# EAGLE design esp-07:12:12e (EAGLE 7.3.0)
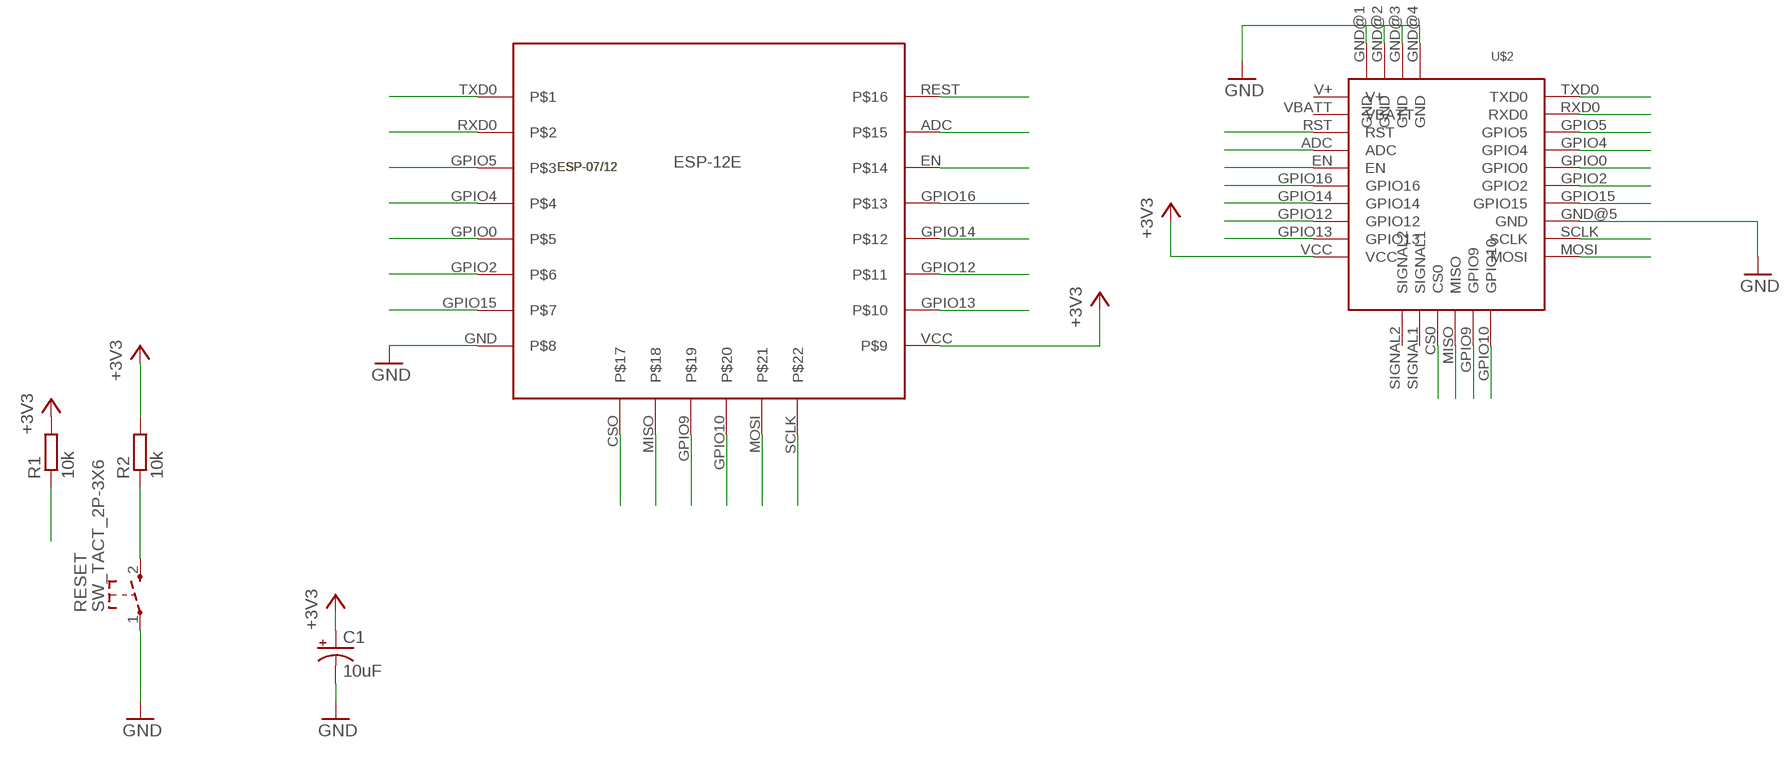
[diagram p0: schematic, sheet 1]

## Parts
C1  10uF  10UF-16V-10%(TANT)  [EIA3216]
R1  10k  RESISTOR-1206  [R1206]
R2  10k  RESISTOR-1206  [R1206]
RESET  SW_TACT_2P-3X6  [SW_TACT_3X6]
U$1  ESP-07/12_ESP-12E  [ESP-07/12]
U$2  ESP-BOARD  [ESP-BOARD]

## Nets
+3V3: C1.A(+) R1.2 R2.2 U$1.VCC U$2.VCC
ADC: U$1.ADC U$2.ADC
CS0: U$1.CSO U$2.CS0
EN: R1.1 U$1.EN U$2.EN
GND: C1.C(-) RESET.1 U$1.GND U$2.GND@1(GND) U$2.GND@2(GND) U$2.GND@3(GND) U$2.GND@4(GND) U$2.GND@5(GND)
GPIO0: U$1.GPIO0 U$2.GPIO0
GPIO2: U$1.GPIO2 U$2.GPIO2
GPIO4: U$1.GPIO4 U$2.GPIO4
GPIO5: U$1.GPIO5 U$2.GPIO5
GPIO9: U$1.GPIO9 U$2.GPIO9
GPIO10: U$1.GPIO10 U$2.GPIO10
GPIO12: U$1.GPIO12 U$2.GPIO12
GPIO13: U$1.GPIO13 U$2.GPIO13
GPIO14: U$1.GPIO14 U$2.GPIO14
GPIO15: U$1.GPIO15 U$2.GPIO15
GPIO16: U$1.GPIO16 U$2.GPIO16
MISO: U$1.MISO U$2.MISO
MOSI: U$1.MOSI U$2.MOSI
RESET: R2.1 RESET.2 U$1.REST U$2.RST
RXD0: U$1.RXD0 U$2.RXD0
SCLK: U$1.SCLK U$2.SCLK
TXD0: U$1.TXD0 U$2.TXD0
Unconnected: U$2.SIGNAL1 U$2.SIGNAL2

## Power pins joined to a net without a drawn wire
V+: U$2.V+
VBATT: U$2.VBATT

## Library data of the parts
C1 = SparkFun-Capacitors:10UF-16V-10%(TANT): CAP-00811 1206/EIA-3216 Tantalum capacitor; PROD_ID: CAP-00811
R1 R2 = dp_devices:RESISTOR
RESET = dp_devices:SW_TACT_2P
U$1 = ESP-12E:ESP-07/12: Version 1.0 of the library for the ESP-07/12 full GPIO dev board module byME Jon jonnyradu@gmail.com
U$2 = ESPstack:ESP-BOARD: STANDARIZED ESP-STACK BOARD

## Board
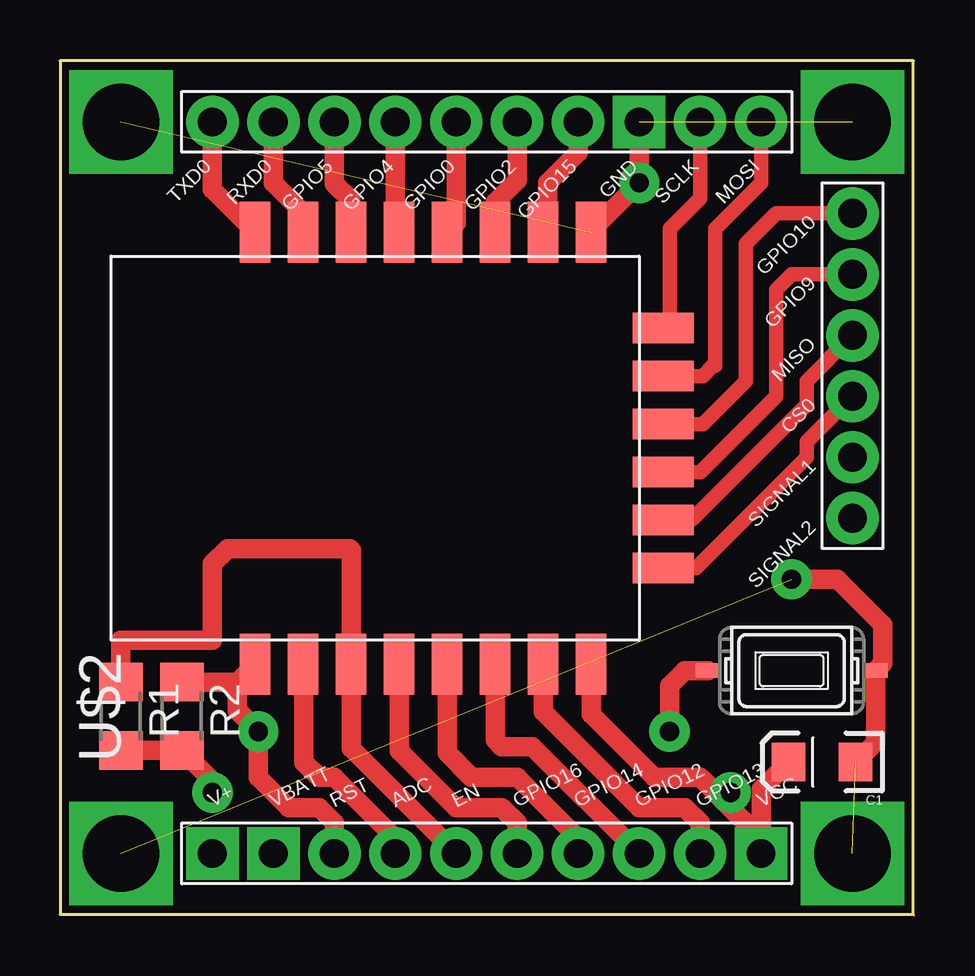
[diagram p1: board, top side]
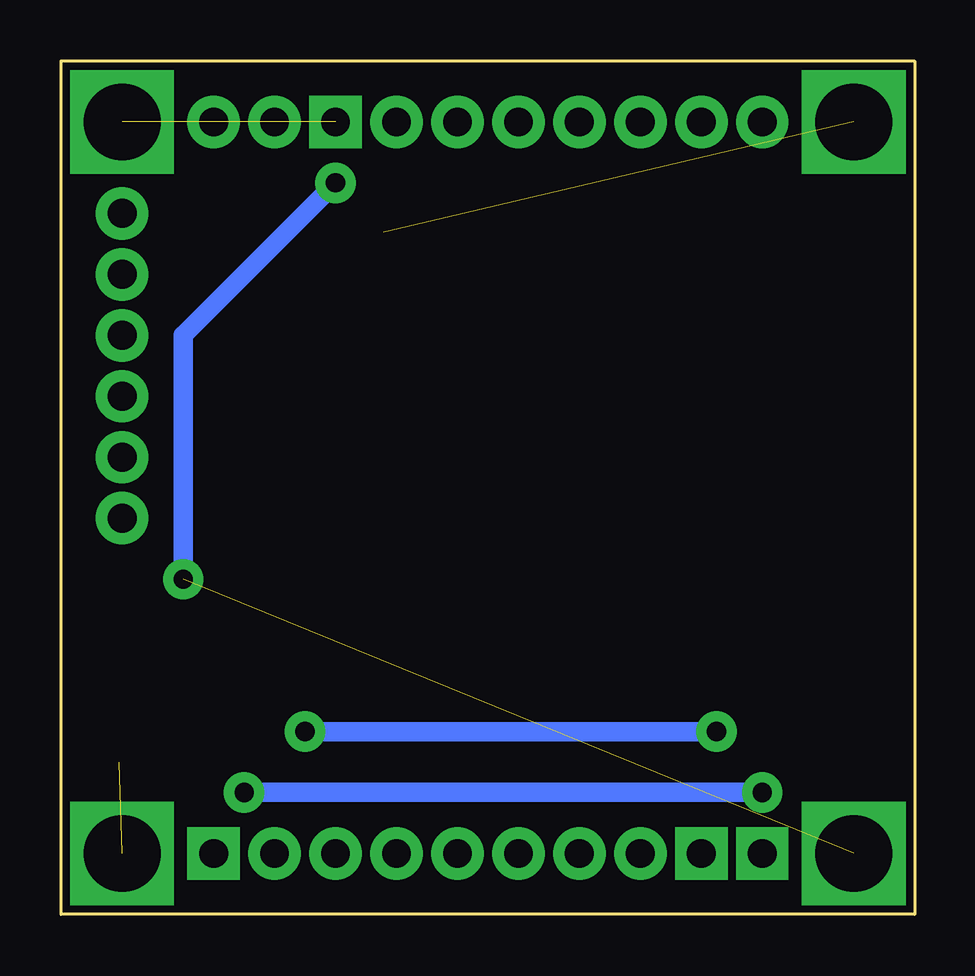
[diagram p2: board, bottom side, seen from below]

Size 35.61 x 35.65 mm. Coordinates in mm from the lower left corner, seen from the top.
Outline: 35.61,0 0,0.05 0,35.6 35.61,35.65
Copper layers (1*16): Top 0.035mm / dielectric 1.5mm / Bottom 0.035mm
Design rules "default": minimum track width 10mil, minimum drill 24mil, track to track 8mil, track to pad 8mil, pad to pad 8mil, via to via 8mil, smd to smd 8mil, copper to edge 40mil, drill to drill 8mil, minimum pad ring 10mil, minimum via ring 8mil, stop-mask expansion 4mil, vias tented up to drill 0mil, thermal gap 10mil

### Footprints (pad centres in the part's own frame; a part is rotated, then mirrored left to right if it is on the bottom)
EIA3216 = smd 1.4 x 1.6: A 1.4,0; C -1.4,0
R1206 = smd 1.6 x 1.803: 1 -1.422,0; 2 1.422,0
SW_TACT_3X6 = smd 1 x 0.6: 1 -3.5,0; 2 3.5,0
ESP-07/12 = smd 2.54 x 1.27: ADC -1,14; EN -1,12; GND 17,2; GPIO0 17,8; GPIO2 17,6; GPIO4 17,10; GPIO5 17,12; GPIO12 -1,6; GPIO13 -1,4; GPIO14 -1,8; GPIO15 17,4; GPIO16 -1,10; REST -1,16; RXD0 17,14; TXD0 17,16; VCC -1,2 | smd 1.27 x 2.54: CSO 3,-1; GPIO9 7,-1; GPIO10 9,-1; MISO 5,-1; MOSI 11,-1; SCLK 13,-1
ESP-BOARD = drill 1.2 pad 2.184: ADC -10.16,-16.51; CS0 8.89,2.54; EN -7.62,-16.51; GPIO0 -7.62,13.97; GPIO2 -5.08,13.97; GPIO4 -10.16,13.97; GPIO5 -12.7,13.97; GPIO9 8.89,7.62; GPIO10 8.89,10.16; GPIO12 0,-16.51; GPIO13 2.54,-16.51; GPIO14 -2.54,-16.51; GPIO15 -2.54,13.97; GPIO16 -5.08,-16.51; MISO 8.89,5.08; MOSI 5.08,13.97; RST -12.7,-16.51; RXD0 -15.24,13.97; SCLK 2.54,13.97; SIGNAL1 8.89,0; SIGNAL2 8.89,-2.54; TXD0 -17.78,13.97 | drill 3.2 pad 4.318 square: GND@1 -21.59,13.97; GND@2 8.89,13.97; GND@3 -21.59,-16.51; GND@4 8.89,-16.51 | drill 1.2 pad 2.184 square: GND@5 0,13.97; V+ -17.78,-16.51; VBATT -15.24,-16.51; VCC 5.08,-16.51

### Placement (x,y rotation side)
C1  31.75,6.4 180 top
R1  2.54,8.31 270 top
R2  5.08,8.31 270 top
RESET  30.48,10.21 180 top
U$1  24.13,11.48 90 top
U$2  24.13,19.1 0 top

### Tracks (layer width: path | path; a pad name or v marks a point on that pad's centre or on a via)
+3V3  (via drill 0.8 pad 1.68)
  Top 0.813: U$1.VCC 22.13,8.4 24.77,5.77 26.67,5.77 27.62,4.81 | 27.62,4.81 29.21,3.23 U$2.VCC 29.21,5.26 C1.A | v27.94,5.13 27.62,4.81 | v6.35,5.13 6.35,5.61 R2.2 R1.2
  Bottom 0.813: v6.35,5.13 v27.94,5.13
ADC
  Top 0.813: U$1.ADC 10.16,10.45 10.16,6.4 10.79,5.77 11.43,5.77 13.97,3.23 U$2.ADC
CS0
  Top 0.61: U$1.CSO 26.5,14.48 31.11,19.1 31.11,19.74 U$2.CS0
EN
  Top 0.813: U$2.EN 12.13,6.97 U$1.EN 12.13,15.23 12.06,15.29 6.99,15.29 6.35,14.66 6.35,11.48 2.54,11.48 R1.1
GND  (via drill 0.8 pad 1.68)  (4 unrouted)
  Top 0.813: C1.C 33.98,7.23 RESET.1 34.29,10.52 34.29,12.12 32.38,14.02 v30.48,14.02 | U$2.GND@5 v24.13,30.53 22.13,28.53 U$1.GND
  Bottom 0.813: v24.13,30.53 30.48,24.18 v30.48,14.02
GPIO0
  Top 0.813: U$2.GPIO0 16.51,28.86 U$1.GPIO0
GPIO2
  Top 0.813: U$2.GPIO2 19.05,30.63 18.16,29.74 18.16,28.51 U$1.GPIO2
GPIO4
  Top 0.813: U$2.GPIO4 13.97,28.64 U$1.GPIO4
GPIO5
  Top 0.813: U$2.GPIO5 11.43,30.51 12.12,29.82 12.12,28.49 U$1.GPIO5
GPIO9
  Top 0.61: U$1.GPIO9 26.68,18.48 29.84,21.64 29.84,26.09 30.48,26.72 U$2.GPIO9
GPIO10
  Top 0.61: U$1.GPIO10 26.78,20.48 28.57,22.28 28.57,27.99 29.84,29.26 U$2.GPIO10
GPIO12
  Top 0.813: U$1.GPIO12 18.13,7.32 18.41,7.04 19.68,7.04 U$2.GPIO12
GPIO13
  Top 0.813: U$1.GPIO13 20.13,8.5 24.13,4.5 26.04,4.5 26.67,3.86 U$2.GPIO13
GPIO14
  Top 0.813: U$1.GPIO14 16.13,6.78 17.14,5.77 19.05,5.77 21.59,3.23 U$2.GPIO14
GPIO15
  Top 0.813: U$2.GPIO15 21.59,31.8 20.32,30.53 20.32,28.67 U$1.GPIO15
GPIO16
  Top 0.813: U$1.GPIO16 14.13,6.88 16.51,4.5 18.41,4.5 19.05,3.86 U$2.GPIO16
MISO
  Top 0.61: U$2.MISO 31.11,22.28 31.11,21.28 26.34,16.51 25.16,16.51
  Top 0.813: 25.16,16.51 U$1.MISO
MOSI
  Top 0.61: U$2.MOSI 29.21,30.53 27.3,28.63 27.3,22.91 27.2,22.91 26.77,22.48 U$1.MOSI
  Top 0.813: U$1.MOSI
RESET  (via drill 0.8 pad 1.68)
  Top 0.813: R2.1 7.38,9.73 | 7.38,9.73 U$1.REST | 7.38,9.73 7.38,8.55 v8.26,7.67 8.26,5.77 9.53,4.5 10.79,4.5 11.43,3.86 U$2.RST | v25.4,7.67 25.4,9.58 26.04,10.21 RESET.2
  Bottom 0.813: v8.26,7.67 v25.4,7.67
RXD0
  Top 0.813: U$2.RXD0 8.89,30.53 10.16,29.26 10.16,28.45 | 10.16,27.99 10.16,28.45 | 10.16,28.45 U$1.RXD0
SCLK
  Top 0.61: U$2.SCLK 26.67,29.9 25.4,28.63 25.4,24.75
  Top 0.813: 25.4,24.75 U$1.SCLK
TXD0
  Top 0.813: U$2.TXD0 6.35,30.26 U$1.TXD0